# EAGLE design FG with AD9833 (EAGLE 7.7.0)
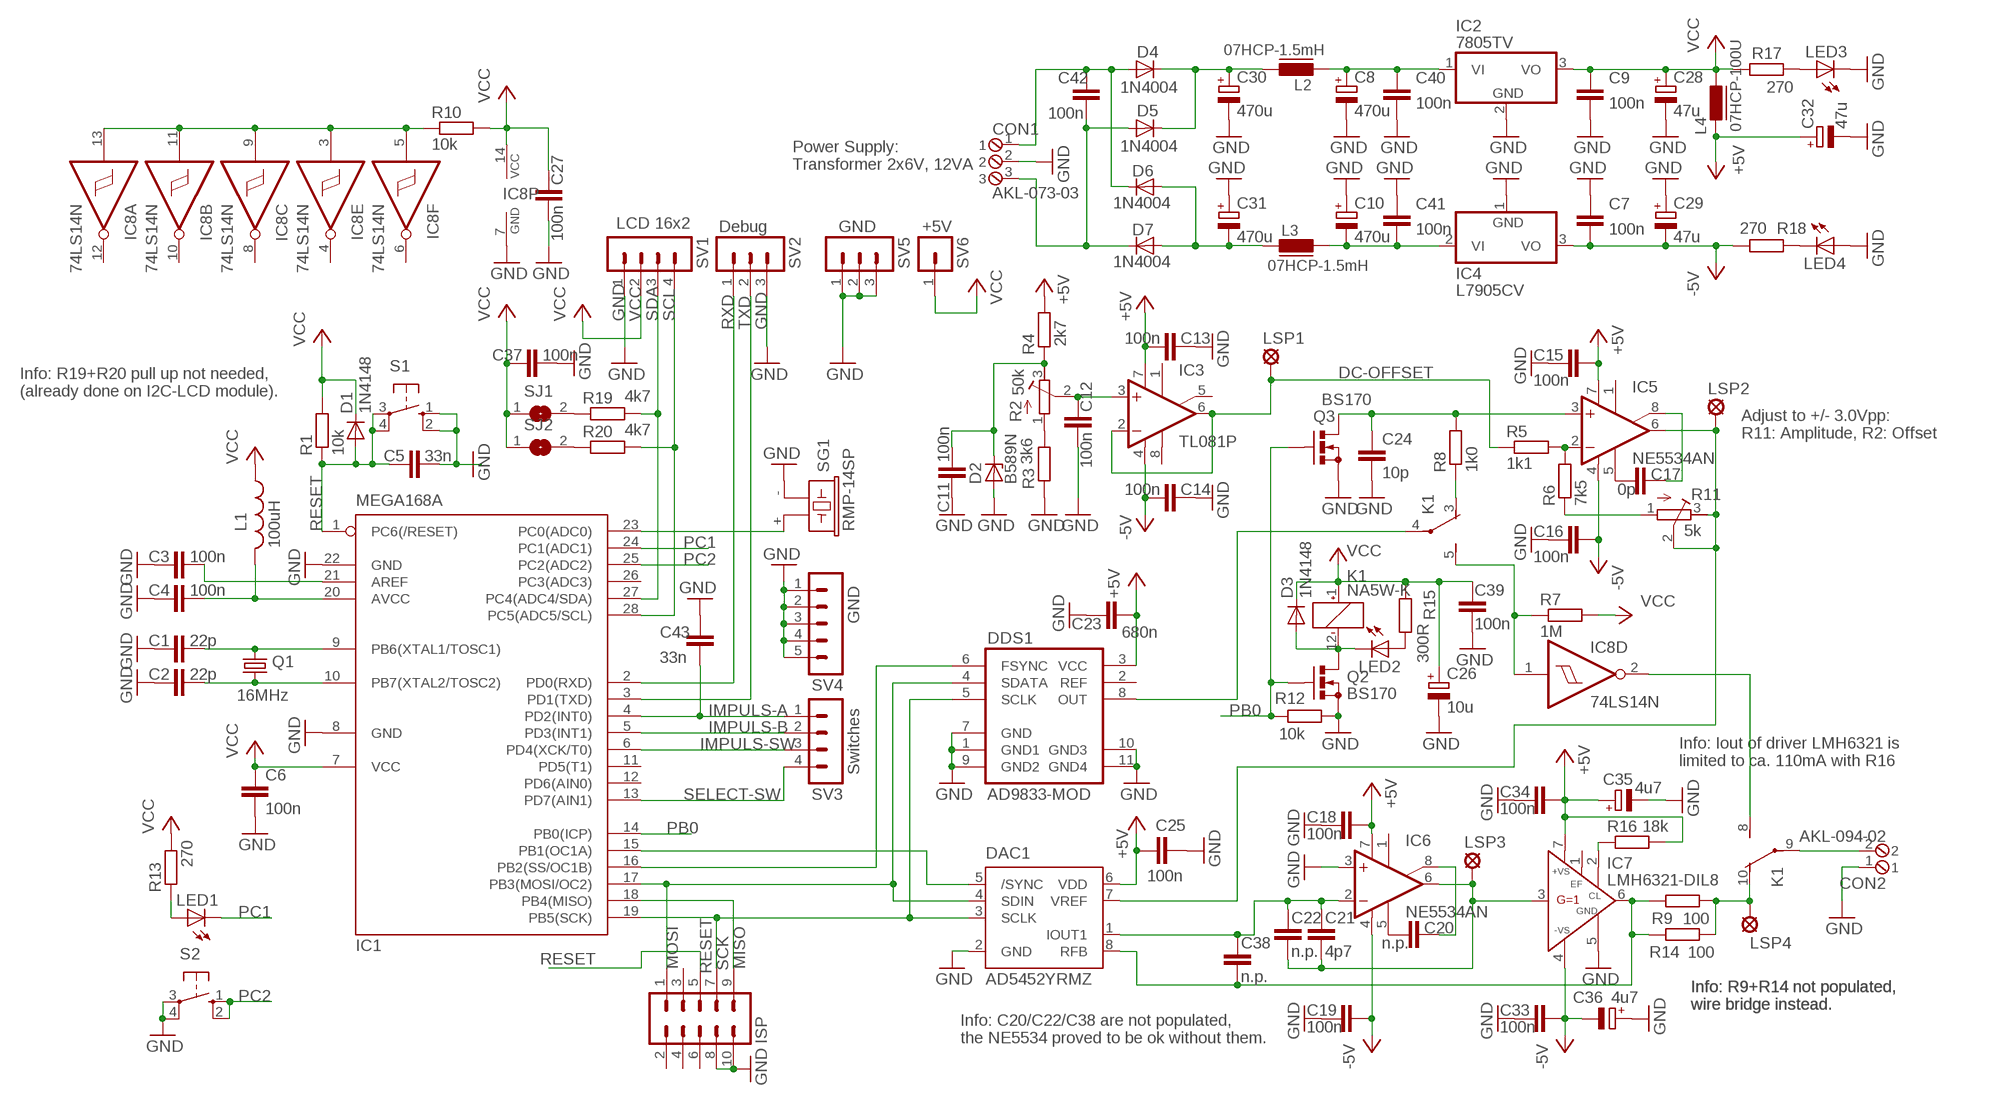
[diagram p0: schematic, sheet 1]

## Parts
C1  22p  C-EU025-024X044  [C025-024X044]
C2  22p  C-EU025-024X044  [C025-024X044]
C3  100n  C-EU050-024X044  [C050-024X044]
C4  100n  C-EU050-024X044  [C050-024X044]
C5  33n  C-EU025-024X044  [C025-024X044]
C6  100n  C-EU050-024X044  [C050-024X044]
C7  100n  C-EU050-024X044  [C050-024X044]
C8  470u  CPOL-EUE3.5-8  [E3,5-8]
C9  100n  C-EU050-024X044  [C050-024X044]
C10  470u  CPOL-EUE3.5-8  [E3,5-8]
C11  100n  C-EU050-024X044  [C050-024X044]
C12  100n  C-EU050-024X044  [C050-024X044]
C13  100n  C-EU050-024X044  [C050-024X044]
C14  100n  C-EU050-024X044  [C050-024X044]
C15  100n  C-EU050-024X044  [C050-024X044]
C16  100n  C-EU050-024X044  [C050-024X044]
C17  0p  C-EU025-024X044  [C025-024X044]
C18  100n  C-EU050-024X044  [C050-024X044]
C19  100n  C-EU050-024X044  [C050-024X044]
C20  n.p.  C-EU025-024X044  [C025-024X044]
C21  4p7  C-EU025-024X044  [C025-024X044]
C22  n.p.  C-EU025-024X044  [C025-024X044]
C23  680n  C-EU050-024X044  [C050-024X044]
C24  10p  C-EU025-024X044  [C025-024X044]
C25  100n  C-EU050-024X044  [C050-024X044]
C26  10u  CPOL-EUTT2D4  [TT2D4]
C27  100n  C-EU050-024X044  [C050-024X044]
C28  47u  CPOL-EUE2.5-6  [E2,5-6]
C29  47u  CPOL-EUE2.5-6  [E2,5-6]
C30  470u  CPOL-EUE3.5-8  [E3,5-8]
C31  470u  CPOL-EUE3.5-8  [E3,5-8]
C32  47u  CPOL-EUE2.5-6  [E2,5-6]
C33  100n  C-EU050-024X044  [C050-024X044]
C34  100n  C-EU050-024X044  [C050-024X044]
C35  4u7  CPOL-EUTT2D4  [TT2D4]
C36  4u7  CPOL-EUTT2D4  [TT2D4]
C37  100n  C-EU050-024X044  [C050-024X044]
C38  n.p.  C-EU025-024X044  [C025-024X044]
C39  100n  C-EU050-024X044  [C050-024X044]
C40  100n  C-EU050-024X044  [C050-024X044]
C41  100n  C-EU050-024X044  [C050-024X044]
C42  100n  C-EU050-024X044  [C050-024X044]
C43  33n  C-EU050-024X044  [C050-024X044]
CON1  AKL-073-03  [AKL-073-03]
CON2  AKL-094-02  [AKL-094-02]
D1  1N4148  1N4148DO35-10  [DO35-10]
D2  B589N  [TO-92H]
D3  1N4148  1N4148DO35-7  [DO35-7]
D4  1N4004  [DO41-10]
D5  1N4004  [DO41-10]
D6  1N4004  [DO41-10]
D7  1N4004  [DO41-10]
DAC1  AD5452YRMZ  [MSOP08]
DDS1  AD9833-MOD  [AD9833-MOD]
IC1  MEGA168A  MEGA8-P  [DIL28-3]
IC2  7805TV  [TO220V]
IC3  TL081P  [DIL08]
IC4  L7905CV  [TO220-V]
IC5  NE5534AN  [DIL08]
IC6  NE5534AN  [DIL08]
IC7  LMH6321-DIL8  [DIL08-ADAP]
IC8  74LS14N  [DIL14]
ISP  ML10  [ML10]
K1  NA5W-K  [HX]
L1  100uH  L-US0207/10  [0207/10]
L2  07HCP-1.5mH  07HCP-100U  [FASTRON_07HCP_INDUCTOR]
L3  07HCP-1.5mH  07HCP-100U  [FASTRON_07HCP_INDUCTOR]
L4  07HCP-100U  [FASTRON_07HCP_INDUCTOR]
LED1  LED5MM  [LED5MM]
LED2  LED5MM  [LED5MM]
LED3  LED5MM  [LED5MM]
LED4  LED5MM  [LED5MM]
LSP1  LSP11  [LSP11]
LSP2  LSP11  [LSP11]
LSP3  LSP11  [LSP11]
LSP4  LSP11  [LSP11]
Q1  16MHz  CRYSTALHC49S  [HC49/S]
Q2  BS170  [SOT54E]
Q3  BS170  [SOT54E]
R1  10k  R-EU_0207/10  [0207/10]
R2  50k  R-TRIMM64W  [RTRIM64W]
R3  3k6  R-EU_0207/10  [0207/10]
R4  2k7  R-EU_0207/10  [0207/10]
R5  1k1  R-EU_0207/10  [0207/10]
R6  7k5  R-EU_0207/10  [0207/10]
R7  1M  R-EU_0207/10  [0207/10]
R8  1k0  R-EU_0207/10  [0207/10]
R9  100  R-EU_0207/10  [0207/10]
R10  10k  R-EU_0207/10  [0207/10]
R11  5k  R-TRIMM64W  [RTRIM64W]
R12  10k  R-EU_0207/10  [0207/10]
R13  270  R-EU_0207/10  [0207/10]
R14  100  R-EU_0207/10  [0207/10]
R15  300R  R-EU_0207/10  [0207/10]
R16  18k  R-EU_0207/10  [0207/10]
R17  270  R-EU_0207/10  [0207/10]
R18  270  R-EU_0207/10  [0207/10]
R19  4k7  R-EU_0207/10  [0207/10]
R20  4k7  R-EU_0207/10  [0207/10]
S1  10-XX  [B3F-10XX]
S2  10-XX  [B3F-10XX]
SG1  RMP-14SP  F/CM12P  [F/CM12P]
SJ1  SJ  [SJ]
SJ2  SJ  [SJ]
SV1  MA04-1  [MA04-1]
SV2  MA03-1  [MA03-1]
SV3  MA04-1  [MA04-1]
SV4  MA05-1  [MA05-1]
SV5  MA03-1  [MA03-1]
SV6  MA01-1  [MA01-1]

## Nets
+5V [Stromversorgung]: C13.2 C15.2 C18.2 C23.2 C25.1 C32.+ C34.2 C35.+ DAC1.6(VDD) DDS1.3(VCC) IC3.7(V+) IC5.7(V+) IC6.7(V+) IC7.7(+VS) L4.1 R4.2 R16.2
-5V [Stromversorgung]: C7.2 C14.2 C16.2 C19.2 C29.- C33.2 C36.- IC3.4(V-) IC4.3(VO) IC5.4(V-) IC6.4(V-) IC7.4(-VS) R18.1
AREF: C3.2 IC1.21(AREF)
AVCC [Stromversorgung]: C4.2 IC1.20(AVCC) L1.2
DC-OFFSET: IC3.2(-IN) IC3.6(OUT) LSP1.MP R5.1
GND [Stromversorgung]: C1.1 C2.1 C3.1 C4.1 C5.2 C6.2 C7.1 C8.- C9.2 C10.+ C11.1 C12.2 C13.1 C14.1 C15.1 C16.1 C18.1 C19.1 C23.1 C24.2 C25.2 C26.- C27.2 C28.- C29.+ C30.- C31.+ C32.- C33.1 C34.1 C35.- C36.+ C37.2 C39.1 C40.2 C41.1 C43.1 CON1.2 CON2.1 D2.2(A) DAC1.2(GND) DDS1.1(GND1) DDS1.7(GND) DDS1.9(GND2) DDS1.10(GND3) DDS1.11(GND4) IC1.8(GND) IC1.22(GND) IC2.2(GND) IC4.1(GND) IC6.3(+IN) IC7.5(GND) IC8.7(P:GND) ISP.8 ISP.10 LED3.K(C) LED4.A Q2.S Q3.S R3.1 R12.1 S1.1(S) S1.2(S1) S2.3(P) S2.4(P1) SG1.- SV1.1 SV2.3 SV4.1 SV4.2 SV4.3 SV4.4 SV4.5 SV5.1 SV5.2 SV5.3
IMPULS-A: C43.2 IC1.4(PD2(INT0)) SV3.1
IMPULS-B: IC1.5(PD3(INT1)) SV3.2
IMPULS-SW: IC1.6(PD4(XCK/T0)) SV3.3
MISO: IC1.18(PB4(MISO)) ISP.9
MOSI: DAC1.4(SDIN) DDS1.4(SDATA) IC1.17(PB3(MOSI/OC2)) ISP.1
N$1: R2.1(A) R3.2
N$2: DDS1.6(FSYNC) IC1.16(PB2(SS/OC1B))
N$3: DAC1.5(/SYNC) IC1.15(PB1(OC1A))
N$4: IC5.2(-IN) R5.2 R6.2
N$5 [Stromversorgung 2]: C8.+ C40.1 IC2.1(VI) L2.1
N$6: IC8.1(D:I) K1.5(2:S) R7.1
N$7 [Stromversorgung 2]: C31.- D6.A D7.A L3.1
N$8: DDS1.8(OUT) K1.4(2:P)
N$9: C17.1 IC5.5(CMP)
N$10: C17.2 IC5.8(ON/CMP)
N$11: K1.3(2:O) R8.1
N$12: R6.1 R11.1(A)
N$13: LED1.A R13.1
N$14 [Stromversorgung 2]: C30.+ D4.C D5.C L2.2
N$15 [Stromversorgung 2]: C10.- C41.2 IC4.2(VI) L3.2
N$16 [Stromversorgung 2]: C42.1 CON1.1 D4.A D6.C
N$17: C21.2 C22.2 IC6.6(OUT) IC7.3(IN) LSP3.MP
N$18: IC1.23(PC0(ADC0)) SG1.+
N$19 [Stromversorgung 2]: C42.2 CON1.3 D5.A D7.C
N$20: IC8.3(E:I) IC8.5(F:I) IC8.9(C:I) IC8.11(B:I) IC8.13(A:I) R10.1
N$21: IC7.2(CL) R16.1
N$22: C38.2 DAC1.8(RFB) IC7.6(OUT) R9.2 R14.2
N$23: K1.10(3:O) LSP4.MP R9.1 R14.1
N$24: LED3.A R17.1
N$25: LED4.K(C) R18.2
N$26: C20.1 IC6.5(CMP)
N$27: R19.1 SJ1.2
N$28: C20.2 IC6.8(ON/CMP)
N$29: C21.1 C22.1 C38.1 DAC1.1(IOUT1) IC6.2(-IN)
N$30: R20.1 SJ2.2
N$31: CON2.2 K1.9(3:P)
N$32: C24.1 IC5.3(+IN) Q3.D R8.2
N$34: C12.1 IC3.3(+IN) R2.2(S)
N$35: C11.2 D2.1(C) R2.3(E) R4.1
N$37: D3.A K1.12(1:-) LED2.K(C) Q2.D
N$38: IC8.2(D:O) K1.8(3:S)
N$48: LED2.A R15.2
OSC1: C1.2 IC1.9(PB6(XTAL1/TOSC1)) Q1.2
OSC2: C2.2 IC1.10(PB7(XTAL2/TOSC2)) Q1.1
PB0: IC1.14(PB0(ICP)) Q2.G Q3.G R12.2
PC1: IC1.24(PC1(ADC1)) LED1.K(C)
PC2: IC1.25(PC2(ADC2)) S2.1(S) S2.2(S1)
RESET: C5.1 D1.A IC1.1(PC6(/RESET)) ISP.5 R1.1 S1.3(P) S1.4(P1)
RXD: IC1.2(PD0(RXD)) SV2.1
SCK: DAC1.3(SCLK) DDS1.5(SCLK) IC1.19(PB5(SCK)) ISP.7
SCL: IC1.28(PC5(ADC5/SCL)) R20.2 SV1.4
SDA: IC1.27(PC4(ADC4/SDA)) R19.2 SV1.3
SELECT-SW: IC1.13(PD7(AIN1)) SV3.4
TXD: IC1.3(PD1(TXD)) SV2.2
VCC [Stromversorgung]: C6.1 C9.1 C26.+ C27.1 C28.+ C37.1 C39.2 D1.C D3.C IC1.7(VCC) IC2.3(VO) IC8.14(P:VCC) K1.1(1:+) L1.1 L4.2 R1.2 R7.2 R10.2 R13.2 R15.1 R17.2 SJ1.1 SJ2.1 SV1.2 SV6.1
VREF: DAC1.7(VREF) IC5.6(OUT) LSP2.MP R11.2(S) R11.3(E)
Unconnected: DDS1.2(REF) IC1.11(PD5(T1)) IC1.12(PD6(AIN0)) IC1.26(PC3(ADC3)) IC3.1(ON1) IC3.5(ON2) IC3.8(OPT) IC5.1(ON) IC6.1(ON) IC7.1(EF) IC8.4(E:O) IC8.6(F:O) IC8.8(C:O) IC8.10(B:O) IC8.12(A:O) ISP.2 ISP.3 ISP.4 ISP.6

## Notes on the sheet
- Power Supply: 
  Transformer 2x6V, 12VA
- Debug | GND | +5V
- LCD 16x2
- Info: R19+R20 pull up not needed,
  (already done on I2C-LCD module).
- Adjust to +/- 3.0Vpp:
  R11: Amplitude, R2: Offset
- GND
- Info: Iout of driver LMH6321 is
  limited to ca. 110mA with R16
- Switches
- Info: R9+R14 not populated,
  wire bridge instead.
- Info: R9+R14 not populated,
  wire bridge instead.
- Info: C20/C22/C38 are not populated,
  the NE5534 proved to be ok without them.

## Library data of the parts
C1-C7 C9 C11-C25 C27 C33 C34 C37-C43 = rcl:C-EU: CAPACITOR, European symbol
C8 C10 C26 C28-C32 C35 C36 = rcl:CPOL-EU: POLARIZED CAPACITOR, European symbol
CON1 = tj-library:AKL-073-03: Riacon AKL-073, Raster 5.08 mm, Polzahl 3
CON2 = tj-library:AKL-094-02: Riacon AKL-094, Raster 5.08 mm, Polzahl 2
D1 D3 = diode:1N4148: DIODE high speed (Philips)
D2 = tj-library:B589N: 1.235V Reference
D4-D7 = diode:1N4004: DIODE general purpose rectifier, 1 A
DAC1 = tj-library:AD5452YRMZ: AD5452YRMZ DAC-Converter with Serial Interface in Package MSOP-8
DDS1 = tj-library:AD9833-MOD: AD9833 DDS-Modul (Made in China)
IC1 = atmel:MEGA8-P: MICROCONTROLLER 8 Kbytes FLASH, 1 kbytes SRAM, 512 bytes EEPROM, USART, 4-channel 10 bit ADC, 2-channel 8 bit ADC Pin compatible with Atmega48, ATMega88, ATMega168 Source: avr.lbr; OC_FARNELL: unknown; OC_NEWARK: unknown
IC2 = linear:78*: Positive VOLTAGE REGULATOR Source: http://cache.national.com/ds/LM/LM78L05.pdf http://www.fairchildsemi.com/ds/LM/LM7805.pdf
IC3 = linear:TL081: OP AMP
IC4 = tj-library:L7905CV: Negative Voltage Regulator
IC5 IC6 = linear:NE5534: LOW-NOISE OPERATIONAL AMPLIFIER Source: http://focus.ti.com/lit/ds/symlink/ne5534.pdf
IC7 = tj-library:LMH6321-DIL8: LMH6321 on SOIC-8 to DIP-8 Adapter
IC8 = 74xx-eu:74*14: Hex schmitt trigger INVERTER
ISP = con-ml:ML10: HARTING; OC_FARNELL: unknown; OC_NEWARK: unknown
K1 = tj-library:NA5W-K: Relais Takamisawa NA5W-K
L1 = rcl:L-US: INDUCTOR, American symbol
L2-L4 = fastron_07HCP:07HCP-*: Fastron 07 HCP Series Inductors (Ferrite Core) (1 … 10000)uH, THT vertical assembly, 5 mm grid / 8.3 mm max. diameter / 10 mm max. height RoHS-Compliant Source: www.fastrongroup.co Technologies: 07HCP-… L/uH RDCmax/Ω IN/A Isat/A 1R0 1 0.06 7.5 10 2R2 2.2 0.01 6 8 3R3 3.3 0.013 5 6.3 4R7 4.7 0.018 4 5.4 6R8 6.8 0.025 3.8 6.5 100 10 0.04 2.6 5 220 22 0.055 2.3 3.6 470 47 0.1 1.3 2.5 680 68 0.14 1.1 2.1 820 82 0.16 1 1.9 101 100 0.19 0.9 1.6 121 120 0.22 0.85 1 221 220 0.38 0.64 1.2 331 330 0.7 0.51 0.85 471 470 0.89 0.43 0.8 821 820 1.56 0.36 0.7 102 1000 1.84 0.3 0.5 182 1800 3.3 0.21 0.35 103 10000 24 0.14 0.17 ±10% / ±20% fL = 1 kHz | 0.25 V Author: Dipl.-Ing. FH Rainer Bayer HHN Hochschule Heilbronn, rainer.bayer@hs-heilbronn.de Ingenieurbüro ing-rb, mail@ing-rb.de; FASTRON#: 07HCP-101
LED1-LED4 = led:LED: LED OSRAM: - CHIPLED LG R971, LG N971, LY N971, LG Q971, LY Q971, LO R971, LY R971 LH N974, LH R974 LS Q976, LO Q976, LY Q976 LO Q996 - Hyper CHIPLED LW Q18S LB Q993, LB Q99A, LB R99A - SideLED LS A670, LO A670, LY A670, LG A670, LP A670 LB A673, LV A673, LT A673, LW A673 LH A674 LY A675 LS A676, LA A676, LO A676, LY A676, LW A676 LS A679, LY A679, LG A679 - Hyper Micro SIDELED® LS Y876, LA Y876, LO Y876, LY Y876 LT Y87S - SmartLED LW L88C, LW L88S LB L89C, LB L89S, LG L890 LS L89K, LO L89K, LY L89K LS L896, LA L896, LO L896, LY L896 - TOPLED LS T670, LO T670, LY T670, LG T670, LP T670 LSG T670, LSP T670, LSY T670, LOP T670, LYG T670 LG T671, LOG T671, LSG T671 LB T673, LV T673, LT T673, LW T673 LH T674 LS T676, LA T676, LO T676, LY T676, LB T676, LH T676, LSB T676, LW T676 LB T67C, LV T67C, LT T67C, LS T67K, LO T67K, LY T67K, LW E67C LS E67B, LA E67B, LO E67B, LY E67B, LB E67C, LV E67C, LT E67C LW T67C LS T679, LY T679, LG T679 LS T770, LO T770, LY T770, LG T770, LP T770 LB T773, LV T773, LT T773, LW T773 LH T774 LS E675, LA E675, LY E675, LS T675 LS T776, LA T776, LO T776, LY T776, LB T776 LHGB T686 LT T68C, LB T68C - Hyper Mini TOPLED® LB M676 - Mini TOPLED Santana® LG M470 LS M47K, LO M47K, LY M47K Source: http://www.osram.convergy.de LUXEON: - LUMILED® LXK2-PW12-R00, LXK2-PW12-S00, LXK2-PW14-U00, LXK2-PW14-V00 LXK2-PM12-R00, LXK2-PM12-S00, LXK2-PM14-U00 LXK2-PE12-Q00, LXK2-PE12-R00, LXK2-PE12-S00, LXK2-PE14-T00, LXK2-PE14-U00 LXK2-PB12-K00, LXK2-PB12-L00, LXK2-PB12-M00, LXK2-PB14-N00, LXK2-PB14-P00, LXK2-PB14-Q00 LXK2-PR12-L00, LXK2-PR12-M00, LXK2-PR14-Q00, LXK2-PR14-R00 LXK2-PD12-Q00, LXK2-PD12-R00, LXK2-PD12-S00 LXK2-PH12-R00, LXK2-PH12-S00 LXK2-PL12-P00, LXK2-PL12-Q00, LXK2-PL12-R00 Source: www.luxeon.com KINGBRIGHT: KA-3528ASYC Source: www.kingbright.com
LSP1-LSP4 = solpad:LSP11: SOLDER PAD drill 1.1 mm
Q1 = crystal:CRYSTAL: CRYSTAL; OC_FARNELL: 1667008; OC_NEWARK: unknown
Q2 Q3 = transistor-small-signal:BS170: N-CHANNEL MOS FET
R1 R3-R10 R12-R20 = rcl:R-EU_: RESISTOR, European symbol
R2 R11 = rcl:R-TRIMM: Trimm resistor
S1 S2 = switch-omron:10-XX: OMRON SWITCH; MPN: B3F-1000; OC_FARNELL: 176432; OC_NEWARK: 36M3542
SG1 = buzzer:F/CM12P: BUZZER Source: Buerklin; OC_FARNELL: unknown; OC_NEWARK: unknown
SJ1 SJ2 = jumper:SJ: SMD solder JUMPER
SV1 SV3 = con-lstb:MA04-1: PIN HEADER; OC_FARNELL: unknown; OC_NEWARK: unknown
SV2 SV5 = con-lstb:MA03-1: PIN HEADER; OC_FARNELL: unknown; OC_NEWARK: unknown
SV4 = con-lstb:MA05-1: PIN HEADER; OC_FARNELL: unknown; OC_NEWARK: unknown
SV6 = tj-library:MA01-1: PIN HEADER

## Net classes
0 default: width 0.406 mm, clearance 0.203 mm
1 Stromversorgung: width 0.406 mm, clearance 0.203 mm
2 Stromversorgung 2: width 1.422 mm, clearance 0.61 mm

## Board
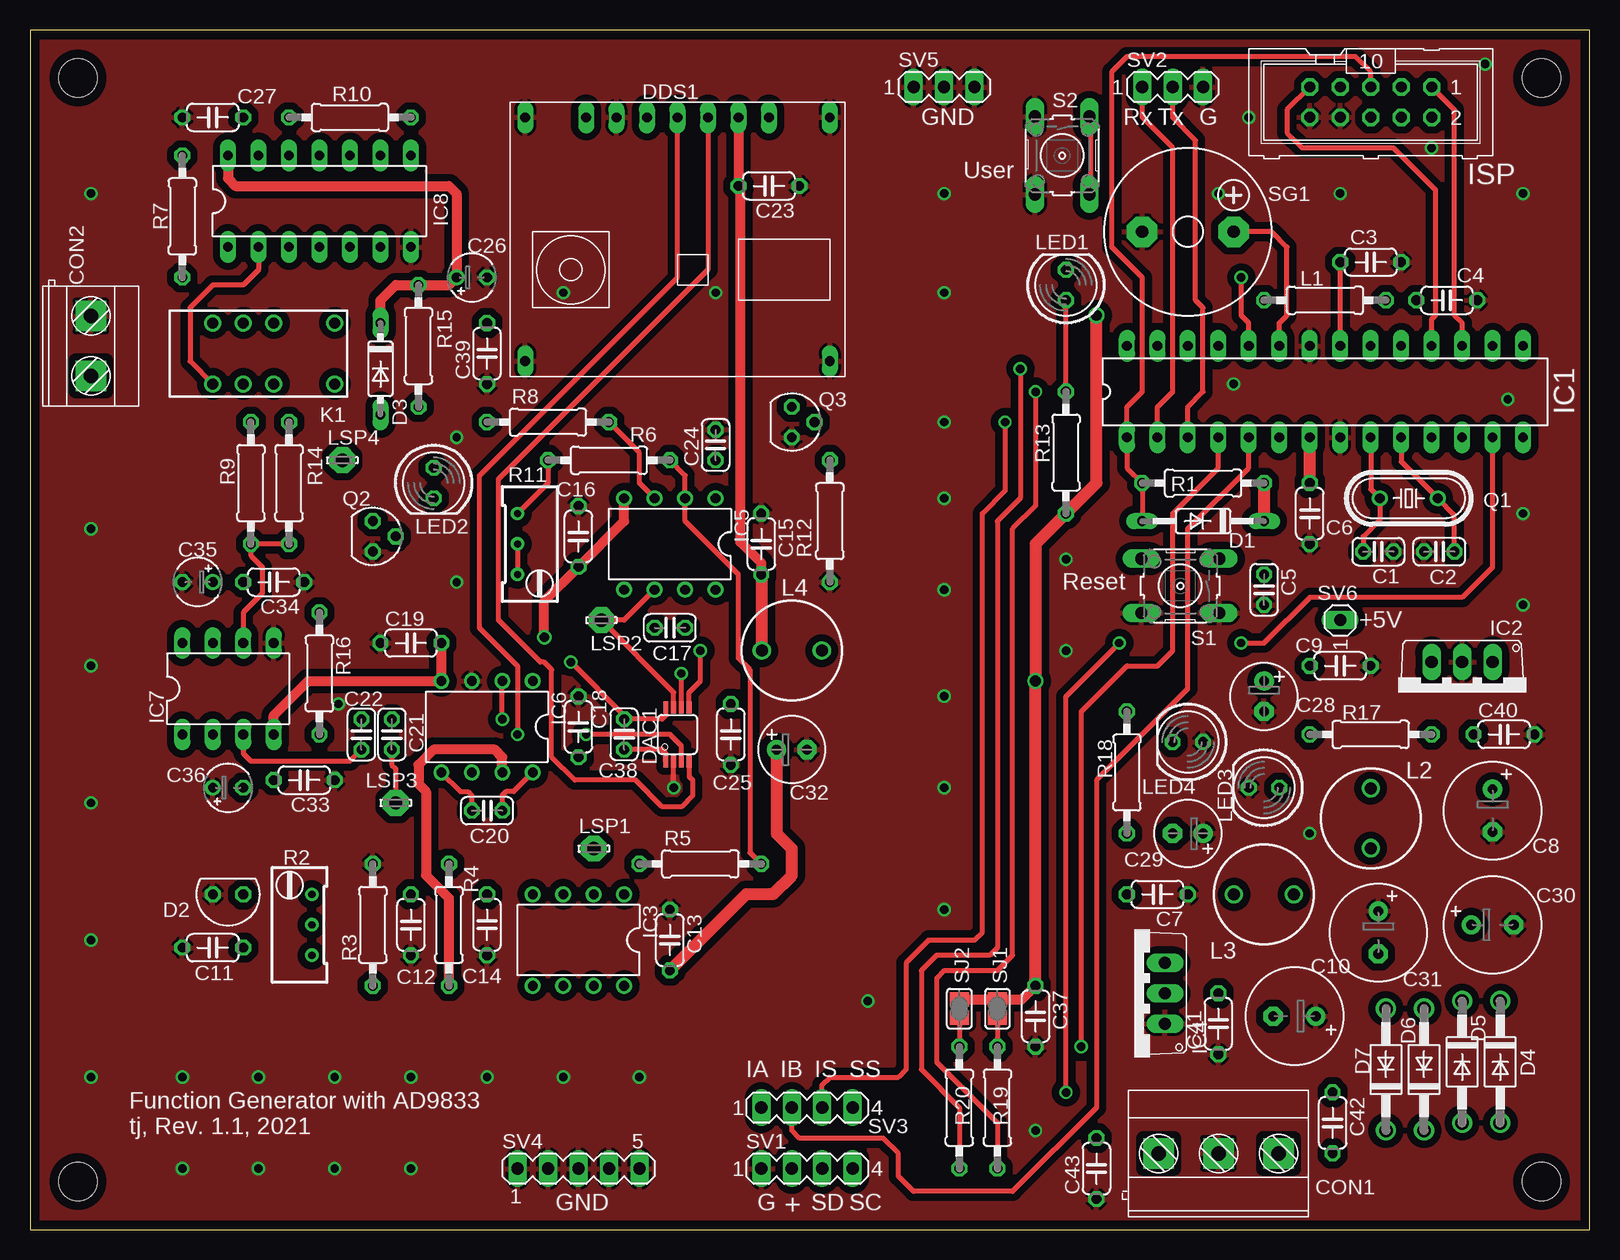
[diagram p1: board, top side]
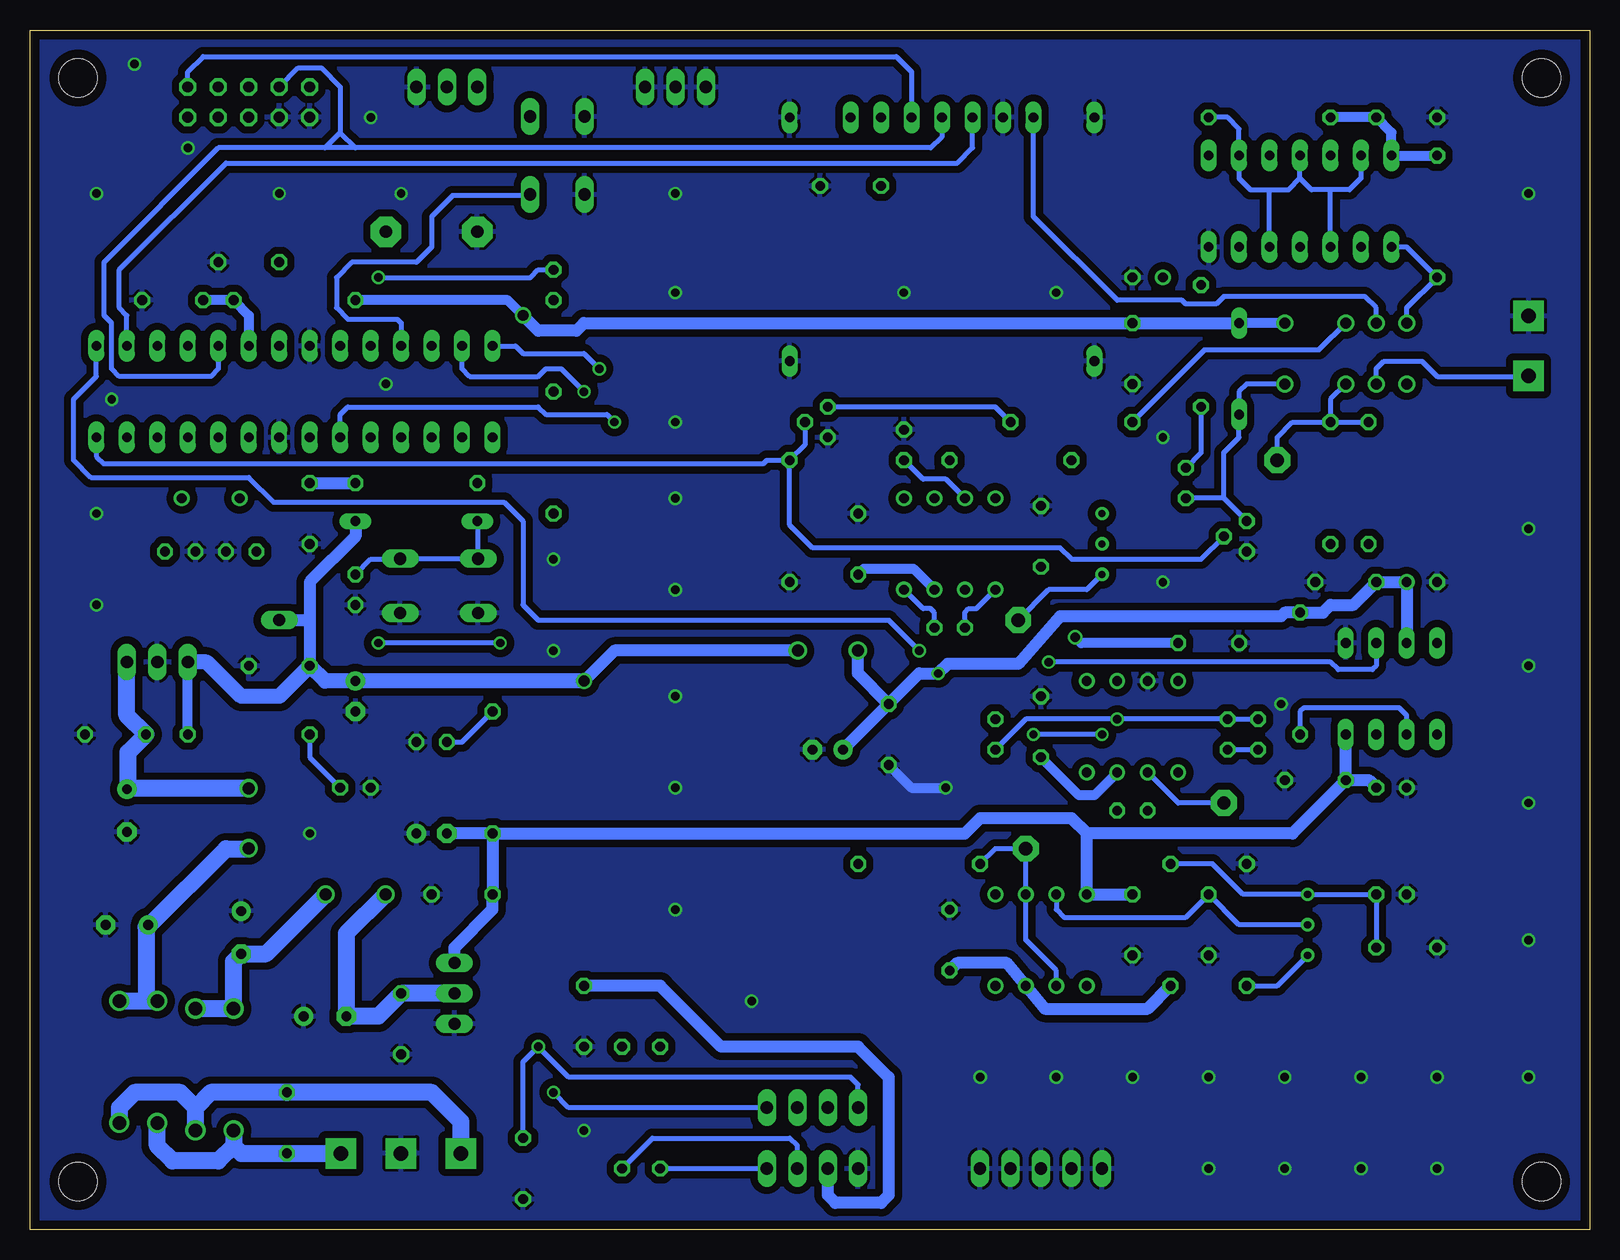
[diagram p2: board, bottom side, seen from below]

Size 130 x 100 mm. Coordinates in mm from the lower left corner, seen from the top.
Outline: 0,0 130,0 130,100 0,100 0,0
Copper layers (1*16): Top 0.035mm / dielectric 1.5mm / Bottom 0.035mm
Design rules "default *": minimum track width 10mil, minimum drill 24mil, track to track 8mil, track to pad 8mil, pad to pad 8mil, via to via 8mil, smd to smd 8mil, copper to edge 30mil, drill to drill 8mil, minimum pad ring 10mil, minimum via ring 8mil, stop-mask expansion 4mil, vias tented up to drill 0mil, thermal gap 10mil
Holes 3.2 mm at 4,96 4,4 126,4 126,96

### Footprints (pad centres in the part's own frame; a part is rotated, then mirrored left to right if it is on the bottom)
C025-024X044 = drill 0.813 octagon: 1 -1.27,0; 2 1.27,0
C050-024X044 = drill 0.813 octagon: 1 -2.54,0; 2 2.54,0
E3,5-8 = drill 0.813 pad 1.6: + -1.778,0 | drill 0.813 pad 1.6 octagon: - 1.778,0
TT2D4 = drill 0.813: + -1.27,0 | drill 0.813 octagon: - 1.27,0
E2,5-6 = drill 0.813 pad 1.6: + -1.27,0 | drill 0.813 pad 1.6 octagon: - 1.27,0
AKL-073-03 = drill 1.2 pad 2.54 square: 1 -4.98,0; 2 0.02,0; 3 5.02,0
AKL-094-02 = drill 1.2 pad 2.54 square: 1 -2.5,0; 2 2.5,0
DO35-10 = drill 0.813 long: A 5.08,0; C -5.08,0
TO-92H = drill 0.813 octagon: 1 -1.27,0; 2 1.27,0
DO35-7 = drill 0.813 long: A 3.81,0; C -3.81,0
DO41-10 = drill 1.118: A 5.08,0; C -5.08,0
MSOP08 = smd 0.4 x 1: 1 -0.976,-2.263; 2 -0.326,-2.263; 3 0.324,-2.263; 4 0.974,-2.263; 5 0.974,2.262; 6 0.324,2.262; 7 -0.326,2.262; 8 -0.976,2.262
AD9833-MOD = drill 0.813 long: 1 -12.7,-10.16; 2 -7.62,-10.16; 3 -5.08,-10.16; 4 -2.54,-10.16; 5 0,-10.16; 6 2.54,-10.16; 7 5.08,-10.16; 8 7.62,-10.16; 9 12.7,-10.16; 10 12.7,10.16; 11 -12.7,10.16
DIL28-3 = drill 0.813 long: 1 -16.51,-3.81; 2 -13.97,-3.81; 3 -11.43,-3.81; 4 -8.89,-3.81; 5 -6.35,-3.81; 6 -3.81,-3.81; 7 -1.27,-3.81; 8 1.27,-3.81; 9 3.81,-3.81; 10 6.35,-3.81; 11 8.89,-3.81; 12 11.43,-3.81; 13 13.97,-3.81; 14 16.51,-3.81; 15 16.51,3.81; 16 13.97,3.81; 17 11.43,3.81; 18 8.89,3.81; 19 6.35,3.81; 20 3.81,3.81; 21 1.27,3.81; 22 -1.27,3.81; 23 -3.81,3.81; 24 -6.35,3.81; 25 -8.89,3.81; 26 -11.43,3.81; 27 -13.97,3.81; 28 -16.51,3.81
TO220V = drill 1.016 long: 1 -2.54,-2.54; 2 0,-2.54; 3 2.54,-2.54
DIL08 = drill 0.813 pad 1.27: 1 -3.81,-3.81; 2 -1.27,-3.81; 3 1.27,-3.81; 4 3.81,-3.81; 5 3.81,3.81; 6 1.27,3.81; 7 -1.27,3.81; 8 -3.81,3.81
TO220-V = drill 1.016 long: 1 -2.54,0; 2 0,0; 3 2.54,0
DIL08-ADAP = drill 0.813 long: 1 -3.81,-3.81; 2 -1.27,-3.81; 3 1.27,-3.81; 4 3.81,-3.81; 5 3.81,3.81; 6 1.27,3.81; 7 -1.27,3.81; 8 -3.81,3.81
DIL14 = drill 0.813 long: 1 -7.62,-3.81; 2 -5.08,-3.81; 3 -2.54,-3.81; 4 0,-3.81; 5 2.54,-3.81; 6 5.08,-3.81; 7 7.62,-3.81; 8 7.62,3.81; 9 5.08,3.81; 10 2.54,3.81; 11 0,3.81; 12 -2.54,3.81; 13 -5.08,3.81; 14 -7.62,3.81
ML10 = drill 0.914 octagon: 1 -5.08,-1.27; 2 -5.08,1.27; 3 -2.54,-1.27; 4 -2.54,1.27; 5 0,-1.27; 6 0,1.27; 7 2.54,-1.27; 8 2.54,1.27; 9 5.08,-1.27; 10 5.08,1.27
HX = drill 0.9: 1 -6.35,-2.54; 3 -1.27,-2.54; 4 1.27,-2.54; 5 3.81,-2.54; 8 3.81,2.54; 9 1.27,2.54; 10 -1.27,2.54; 12 -6.35,2.54
0207/10 = drill 0.813 octagon: 1 -5.08,0; 2 5.08,0
FASTRON_07HCP_INDUCTOR = drill 1: 1 -2.5,0; 2 2.5,0
LED5MM = drill 0.813 octagon: A -1.27,0; K 1.27,0
LSP11 = drill 1.118 pad 2.159 octagon: MP 0,0
HC49/S = drill 0.813: 1 -2.413,0; 2 2.413,0
SOT54E = drill 0.813 octagon: D -1.27,0; G 0,1.905; S 1.27,0
RTRIM64W = drill 0.61: 1 1.27,-2.54; 2 1.27,0; 3 1.27,2.54
B3F-10XX = drill 1.016 long: 1 -3.251,2.261; 2 3.251,2.261; 3 -3.251,-2.261; 4 3.251,-2.261
F/CM12P = drill 1.016 pad 2.54 octagon: + 3.81,0; - -3.81,0
SJ = smd 1.168 x 1.6: 1 -0.762,0; 2 0.762,0
MA04-1 = drill 1.016 long: 1 -3.81,0; 2 -1.27,0; 3 1.27,0; 4 3.81,0
MA03-1 = drill 1.016 long: 1 -2.54,0; 2 0,0; 3 2.54,0
MA05-1 = drill 1.016 long: 1 -5.08,0; 2 -2.54,0; 3 0,0; 4 2.54,0; 5 5.08,0
MA01-1 = drill 1.016 long: 1 0,0

### Placement (x,y rotation side)
C1  112.39,56.52 180 top
C2  117.47,56.52 0 top
C3  111.76,80.64 180 top
C4  118.11,77.47 180 top
C5  102.87,53.34 270 top
C6  106.68,59.69 270 top
C7  93.98,27.94 180 top
C8  121.92,34.92 270 top
C9  109.22,46.99 0 top
C10  105.41,17.78 180 top
C11  15.24,23.5 0 top
C12  31.75,25.4 270 top
C13  53.34,24.13 270 top
C14  38.1,25.4 90 top
C15  60.96,57.15 270 top
C16  45.72,57.78 270 top
C17  53.34,50.16 0 top
C18  45.72,41.91 270 top
C19  31.75,48.9 0 top
C20  38.1,34.92 0 top
C21  30.16,41.27 270 top
C22  27.62,41.27 270 top
C23  61.59,87 180 top
C24  57.15,65.41 90 top
C25  58.42,41.27 270 top
C26  36.83,79.38 0 top
C27  15.24,92.71 180 top
C28  102.87,44.45 270 top
C29  96.52,33.02 180 top
C30  121.92,25.4 0 top
C31  112.39,24.77 270 top
C32  63.5,40.01 0 top
C33  22.86,37.47 180 top
C34  20.32,53.98 180 top
C35  13.97,53.98 180 top
C36  16.51,36.83 0 top
C37  83.82,17.78 270 top
C38  49.53,41.27 90 top
C39  38.1,73.03 90 top
C40  122.87,41.27 0 top
C41  99.06,17.14 90 top
C42  108.58,8.89 270 top
C43  88.9,5.08 90 top
CON1  99.06,6.35 0 top
CON2  5.08,73.66 270 top
D1  97.79,59.05 180 top
D2  16.51,27.94 180 top
D3  29.21,71.75 270 top
D4  122.56,13.97 270 top
D5  119.38,13.97 270 top
D6  116.2,13.34 90 top
D7  113.03,13.34 90 top
DAC1  53.98,41.27 0 top
DDS1  53.98,82.55 180 top
IC1  107.95,69.85 0 top
IC2  119.38,44.77 180 top
IC3  45.72,24.13 180 top
IC4  94.61,19.68 90 top
IC5  53.34,57.15 180 top
IC6  38.1,41.91 180 top
IC7  16.51,45.09 0 top
IC8  24.13,85.72 0 top
ISP  111.76,93.98 180 top
K1  19.05,73.03 180 top
L1  107.95,77.47 0 top
L2  111.76,34.29 270 top
L3  102.87,27.94 180 top
L4  63.5,48.26 0 top
LED1  86.36,78.74 90 top
LED2  33.66,62.23 270 top
LED3  102.87,36.83 180 top
LED4  96.52,40.64 180 top
LSP1  46.99,31.75 0 top
LSP2  47.62,50.8 0 top
LSP3  30.48,35.56 0 top
LSP4  26.04,64.14 0 top
Q1  114.94,60.96 180 top
Q2  28.57,57.78 270 top
Q3  63.5,67.31 270 top
R1  97.79,62.23 0 top
R2  22.23,25.4 0 top
R3  28.57,25.4 270 top
R4  34.92,25.4 270 top
R5  55.88,30.48 0 top
R6  48.26,64.14 0 top
R7  12.7,84.45 90 top
R8  43.18,67.31 0 top
R9  18.41,62.23 270 top
R10  26.67,92.71 180 top
R11  41.91,57.15 180 top
R12  66.67,59.05 90 top
R13  86.36,64.77 270 top
R14  21.59,62.23 270 top
R15  32.38,73.66 270 top
R16  24.13,46.35 90 top
R17  111.76,41.27 0 top
R18  91.44,38.1 90 top
R19  80.64,10.16 270 top
R20  77.47,10.16 270 top
S1  95.89,53.66 180 top
S2  86.04,89.53 270 top
SG1  96.52,83.19 0 top
SJ1  80.64,18.41 270 top
SJ2  77.47,18.41 270 top
SV1  64.77,5.08 0 top
SV2  95.25,95.25 0 top
SV3  64.77,10.16 0 top
SV4  45.72,5.08 0 top
SV5  76.2,95.25 0 top
SV6  109.22,50.8 90 top

### Tracks (layer width: path | path; a pad name or v marks a point on that pad's centre or on a via)
+5V  (via drill 0.7)
  Top 0.406: DAC1.6 v54.3,46.35 v54.29,46.35
  Top 0.813: R4.2 34.92,27.62 33.02,29.53 33.02,36.51 32.38,37.15 32.38,38.73 33.66,40.01 38.73,40.01 39.37,39.37 IC6.7 | DDS1.3 C23.2 59.21,86.84 59.21,57.31 60.96,55.56 C15.2
  Top 1.016: C32.+ 62.23,33.02 63.5,31.75 63.5,29.53 61.91,27.94 59.69,27.94 C13.2 | C15.2 60.96,48.3 L4.1
  Bottom 0.813: IC5.7 56.36,55.09 60.48,55.09 C15.2 | IC6.7 41.27,36.2 42.55,36.2 C18.2
  Bottom 1.016: IC7.7 C35.+ C34.2 19.68,52.07 21.59,52.07 22.23,51.44 R16.2 25.4,51.44 25.72,51.12 44.13,51.12 47.62,47.15 53.5,47.15 v54.29,46.35 55.88,46.35 C25.1 | C25.1 C32.+ | R4.2 36.83,18.41 45.4,18.41 IC3.7 48.58,22.23 52.7,22.23 C13.2 | C25.1 61,46.4 L4.1
-5V  (via drill 0.8)
  Top 0.813: C19.2 IC6.4 23.18,45.72 20.32,42.86 IC7.4 | v42.86,49.37 42.86,52.39 C16.2 49.53,59.05 IC5.4
  Bottom 0.813: C33.2 20.64,37.31 20.64,37.15 | v42.86,49.37 42.39,48.9 C19.2
  Bottom 1.016: C14.2 IC3.4 41.91,33.02 | C36.- 18.41,37.47 C33.2 IC7.4 | R18.1 C29.- | R18.1 C7.2 91.44,26.67 94.61,23.5 IC4.3 | 20.64,37.15 24.77,33.02 41.91,33.02 | 41.91,33.02 43.18,34.29 50.8,34.29 52.07,33.02 R18.1
AREF
  Top 0.406: IC1.21 C3.2
AVCC
  Bottom 0.813: C4.2 L1.2 111.76,76.2 IC1.20
DC-OFFSET
  Bottom 0.406: R5.1 49.53,31.75 LSP1.MP IC3.2 46.99,24.13 44.45,21.59 IC3.6
GND  (via drill 0.7)
  Top 0.406: v53.66,36.83 DAC1.2
  Bottom 0.813: C25.2 56.52,36.83 v53.66,36.83
  other vias: 12.7,5.08 19.05,5.08 25.4,5.08 31.75,5.08 69.85,19.05 76.2,26.67 106.68,33.02 76.2,36.83 76.2,44.45 76.2,53.34 76.2,60.96 76.2,67.31 76.2,86.36 101.6,92.71 109.22,86.36 44.45,78.11 57.15,78.11 123.19,69.22 121.28,97.16 124.46,86.36 124.46,59.69 124.46,52.07 25.72,43.81 35.56,53.98 35.56,66.04 5.08,12.7 5.08,24.13 5.08,35.56 5.08,46.99 5.08,58.42 5.08,86.36 100.33,70.48 99.06,86.36 86.36,55.88 86.36,48.26 76.2,78.11 12.7,12.7 19.05,12.7 25.4,12.7 31.75,12.7 38.1,12.7 44.45,12.7 50.8,12.7 83.82,8.26 116.84,90.17
  pour Bottom (isolate 0.61): 0,0 0,100.01 130.18,100.01 130.18,0
  pour Top (isolate 0.61): 0,0 0,100.01 130.18,100.01 130.18,0
IMPULS-A  (via drill 0.7)
  Top 0.406: IC1.4 99.06,63.5 95.25,59.69 95.25,48.26 93.98,46.99 91.44,46.99 87.63,43.18 v87.63,15.24
  Bottom 0.406: SV3.1 60.96,12.06 61.59,12.7 85.09,12.7 v87.63,15.24 88.9,13.97 C43.2
IMPULS-B
  Top 0.406: IC1.5 101.6,63.5 96.52,58.42 96.52,45.09 88.9,37.47 88.9,10.16 81.92,3.17 73.66,3.17 72.39,4.45 72.39,6.35 71.12,7.62 64.14,7.62 63.5,8.26 SV3.2
IMPULS-SW  (via drill 0.7)
  Top 0.406: v81.28,67.31 81.28,61.59 79.38,59.69 79.38,24.77 78.74,24.13 74.93,24.13 73.03,22.23 73.03,13.34 72.39,12.7 66.67,12.7 66.04,12.06 SV3.3
  Bottom 0.406: IC1.6 104.14,67.94 103.5,68.58 87.63,68.58 87,67.94 81.92,67.94 v81.28,67.31
MISO
  Top 0.406: ISP.9 104.78,93.34 104.78,91.44 106.05,90.17 113.67,90.17 117.16,86.68 117.16,76.2 116.84,75.88 IC1.18
MOSI
  Top 0.406: DAC1.4 54.95,37.76 55.24,37.47 55.24,36.2 54.29,35.24 52.7,35.24 50.48,37.47 45.4,37.47 43.5,39.37 43.5,46.67 42.86,47.31 42.55,47.31 39.05,50.8 39.05,62.55 56.52,80.01 DDS1.4 | ISP.1 118.75,93.34 118.75,76.2 119.38,75.56 IC1.17
  Bottom 0.406: ISP.1 116.84,96.52 115.57,97.79 57.78,97.79 56.52,96.52 DDS1.4
N$1
  Bottom 0.406: R2.1 26.04,20.32 R3.2
N$2
  Bottom 0.406: IC1.16 121.92,76.2 122.56,76.83 122.56,80.01 113.67,88.9 52.7,88.9 51.44,90.17 DDS1.6
N$3  (via drill 0.7)
  Top 0.406: DAC1.5 54.95,44.79 55.88,45.72 v55.88,48.26
  Bottom 0.406: IC1.15 124.46,71.12 126.36,69.22 126.36,64.14 124.94,62.71 111.76,62.71 109.7,60.64 90.49,60.64 88.9,59.05 88.9,52.07 87.63,50.8 58.42,50.8 v55.88,48.26
N$4
  Top 0.406: R5.2 60.01,31.43 60.01,46.67 59.05,47.62 59.05,54.61 54.61,59.05 IC5.2 54.61,62.87 R6.2
N$5
  Bottom 1.422: L2.1 121.83,36.79 | 121.83,36.79 C8.+ | 121.83,36.79 121.83,39.77 C40.1 121.92,42.86 IC2.1
N$6
  Bottom 0.406: K1.5 15.24,76.83 R7.1 15.24,81.92 IC8.1
N$7
  Bottom 1.422: D6.A D7.A 113.03,20 113.03,22.35 C31.- 110.32,22.99 L3.1
N$8
  Bottom 0.406: K1.4 17.78,76.83 18.73,77.79 30.48,77.79 31.11,77.15 33.66,77.15 33.97,77.47 39.37,77.47 46.35,84.45 DDS1.8
N$9
  Bottom 0.406: C17.1 52.07,51.44 51.75,51.75 51.12,51.75 IC5.5
N$10
  Bottom 0.406: C17.2 54.61,51.44 54.93,51.75 55.56,51.75 IC5.8
N$11
  Bottom 0.406: K1.3 22.54,73.34 32.07,73.34 R8.1
N$12
  Top 0.406: R11.1 43.18,62.23 R6.1
N$13
  Top 0.406: R13.1 LED1.A
N$14
  Bottom 1.422: D4.C 120.33,19.05 | 120.33,19.05 D5.C | L2.2 111.8,31.75 113.67,31.75 120.02,25.4 C30.+ 120.33,25.21 120.33,19.05
N$15
  Bottom 1.422: IC4.2 C41.2 100.97,17.78 C10.- 103.63,24.68 L3.2
N$16
  Bottom 1.422: D6.C 116.2,10.16 | 116.2,10.16 117.47,11.43 121.28,11.43 122.56,10.16 D4.A | 116.2,10.16 114.94,11.43 C42.1 96.52,11.43 94.08,8.99 CON1.1
N$17
  Top 0.406: IC7.3 17.78,39.69 18.41,39.05 26.67,39.05 C22.2 | C21.2 30.16,38.73 30.48,38.42 LSP3.MP
  Bottom 0.406: IC6.6 34.29,35.56 LSP3.MP | C21.2 C22.2
N$18
  Top 0.406: IC1.23 104.14,75.56 104.78,76.2 104.78,81.92 103.5,83.19 SG1.+
N$19
  Bottom 1.422: D7.C 113.03,6.99 | 113.03,6.99 114.3,5.71 118.11,5.71 119.38,6.99 D5.A | 113.03,6.99 112.39,6.35 C42.2 CON1.3
N$20
  Bottom 0.406: R10.1 30.16,92.71 29.21,91.76 IC8.9 29.21,87.63 28.26,86.68 26.67,86.68 | 26.67,86.68 25.08,86.68 24.13,87.63 | 24.13,87.63 IC8.11 | IC8.13 19.05,87.63 20,86.68 21.59,86.68 | 21.59,86.68 23.18,86.68 24.13,87.63 | IC8.3 21.59,86.68 | IC8.5 26.67,86.68
N$21
  Bottom 0.406: IC7.2 15.24,42.86 15.88,43.5 23.81,43.5 24.13,43.18 R16.1
N$22  (via drill 0.7)
  Top 0.406: DAC1.8 53,42.84 52.7,42.55 C38.2 49.53,42.86 v45.09,47.31 | R14.2 R9.2 18.41,56.2 19.37,55.24 19.37,53.02 17.78,51.44 IC7.6
  Bottom 0.406: v45.09,47.31 21.59,47.31 20.95,46.67 18.1,46.67 17.78,46.99 IC7.6
N$23
  Bottom 0.406: K1.10 21.59,69.22 R14.1 | R14.1 R9.1 | LSP4.MP 26.04,66.04 24.77,67.31 R14.1
N$24
  Bottom 0.406: R17.1 106.68,39.37 LED3.A
N$25
  Bottom 0.406: R18.2 93.98,40.64 LED4.K
N$26
  Top 0.406: IC6.5 35.88,36.51 36.51,36.51 36.83,36.2 C20.1
N$27
  Top 0.406: SJ1.2 R19.1
N$28
  Top 0.406: IC6.8 40.32,36.51 39.69,36.51 39.37,36.2 C20.2
N$29  (via drill 0.7)
  Top 0.406: DAC1.1 53,39.71 52.7,40.01 C38.1 | v39.37,42.55 IC6.2
  Bottom 0.406: C38.1 46.99,42.55 v39.37,42.55 C21.1 C22.1
N$30
  Top 0.406: SJ2.2 R20.1
N$31
  Bottom 0.406: K1.9 17.78,71.75 17.14,72.39 13.97,72.39 12.7,71.12 5.12,71.12 CON2.2
N$32
  Top 0.406: IC5.3 50.8,62.23 50.8,64.77 R8.2
  Bottom 0.406: IC5.3 53.66,62.55 55.56,62.55 C24.1 | R8.2 49.53,68.58 Q3.D
N$34
  Bottom 0.406: R2.2 29.21,25.4 C12.1 33.66,26.04 43.81,26.04 44.45,26.67 IC3.3
N$35
  Bottom 0.406: R4.1 31.43,30.48 28.89,27.94 R2.3 D2.1 C11.2
N$37
  Bottom 0.406: K1.12 28.57,70.48 29.21,69.85 D3.A 29.21,66.04 30.48,64.77 30.48,60.96 | Q2.D 30.48,60.96 | 30.48,60.96 LED2.K
N$38
  Top 0.406: IC8.2 19.05,80.01 17.78,78.74 15.24,78.74 13.34,76.83 13.34,72.39 K1.8
N$48
  Bottom 0.406: LED2.A 32.38,64.77 R15.2
OSC1
  Top 0.406: IC1.9 111.76,61.72 Q1.2 112.52,59.18 111.12,57.78 C1.2
OSC2
  Top 0.406: C2.2 118.75,59.56 Q1.1 114.3,64.01 IC1.10
PB0
  Bottom 0.406: Q2.G 32.38,55.88 43.18,55.88 44.13,56.83 64.77,56.83 66.67,58.74 R12.2 | IC1.14 124.46,64.45 123.83,63.82 68.9,63.82 68.58,64.14 R12.2 | Q3.G 65.41,65.41 R12.2
PC1  (via drill 0.7)
  Top 0.406: IC1.24 101.6,75.56 100.97,76.2 v100.97,79.38
  Bottom 0.406: v100.97,79.38 88.27,79.38 87.63,80.01 LED1.K
PC2
  Top 0.406: S2.1 88.42,92.71 88.42,86.36 S2.2
  Bottom 0.406: S2.2 88.42,86.2 94.77,86.2 96.52,84.45 96.52,81.92 97.79,80.64 103.19,80.64 104.46,79.38 104.46,76.83 103.5,75.88 99.38,75.88 99.06,75.56 IC1.25
RESET
  Top 0.406: D1.A R1.1 91.44,63.5 IC1.1 91.44,68.58 92.71,69.85 92.71,79.38 90.17,81.92 90.17,96.52 91.44,97.79 110.49,97.79 111.76,96.52 ISP.5
  Bottom 0.406: C5.1 101.6,55.88 99.17,55.88 S1.3 S1.4 92.63,58.98 D1.A
RXD
  Top 0.406: IC1.2 93.98,68.58 95.25,69.85 95.25,90.17 92.71,92.71 SV2.1
SCK  (via drill 0.7)
  Top 0.406: DAC1.3 54.3,40.32 53.34,41.27 v46.35,41.27 | DDS1.5 53.98,79.38 37.47,62.87 37.47,50.16 40.64,46.99 v40.64,41.27
  Bottom 0.406: 102.87,90.17 54.93,90.17 53.98,91.12 DDS1.5 | ISP.7 107.63,96.84 105.73,96.84 104.14,95.25 104.14,91.44 | 104.14,91.44 105.41,90.17 | 105.41,90.17 114.3,90.17 123.83,80.64 123.83,76.2 123.19,75.56 123.19,71.75 122.56,71.12 114.94,71.12 114.3,71.75 IC1.19 | 104.14,91.44 102.87,90.17 | v40.64,41.27 v46.35,41.27 | 102.87,90.17 105.41,90.17
SCL  (via drill 0.7)
  Top 0.406: v82.55,71.75 82.55,60.96 80.64,59.05 80.64,23.5 80.01,22.86 75.56,22.86 74.3,21.59 74.3,13.34 77.47,10.16 R20.2
  Bottom 0.406: SV1.4 R20.2 | IC1.28 89.53,73.66 88.9,73.03 83.82,73.03 v82.55,71.75
SDA  (via drill 0.7)
  Top 0.406: v83.82,69.85 83.82,60.33 81.92,58.42 81.92,22.86 80.64,21.59 76.2,21.59 75.56,20.95 75.56,13.97 80.64,8.89 R19.2
  Bottom 0.406: SV1.3 66.04,6.99 66.67,7.62 78.11,7.62 R19.2 | IC1.27 93.98,71.75 93.34,71.12 87.63,71.12 87,71.75 85.72,71.75 v83.82,69.85
SELECT-SW  (via drill 0.7)
  Top 0.406: v86.36,11.43 86.36,44.45 v90.81,48.9 | v100.97,48.9 102.87,48.9 106.68,52.7 119.38,52.7 121.92,55.24 IC1.13
  Bottom 0.406: SV3.4 85.09,10.16 v86.36,11.43 | v90.81,48.9 v100.97,48.9
TXD
  Top 0.406: IC1.3 96.52,68.58 97.79,69.85 97.79,76.83 97.16,77.47 97.16,90.81 95.25,92.71 SV2.2
VCC  (via drill 0.9)
  Top 0.813: SJ2.1 SJ1.1 82.68,19.18 C37.1 | D3.C 29.21,77.47 30.48,78.74 R15.1 34.92,78.74 C26.+ 35.56,86.36 34.92,87 17.14,87 16.51,87.63 IC8.14
  Top 1.016: C6.1 IC1.7 | C37.1 v83.82,45.72 83.82,57.15 R13.2 88.9,62.23 v88.9,76.2 | R1.2 D1.C
  Bottom 0.813: R7.2 IC8.14 16.51,91.44 C27.1 R10.2 | R17.2 IC2.3 | v88.9,76.2 90.17,77.47 L1.1 | K1.1 D3.C
  Bottom 1.016: L4.2 81.28,48.26 v83.82,45.72 | C6.1 R1.2 | D1.C 102.87,57.78 106.68,53.98 106.68,50.8 | 106.68,50.8 C9.1 | v88.9,76.2 87.63,74.93 84.45,74.93 83.82,75.56 C39.2 D3.C | C37.1 77.47,20.32 72.39,15.24 60.96,15.24 58.42,12.7 58.42,2.86 59.05,2.22 62.87,2.22 63.5,2.86 SV1.2 | SV6.1 106.68,50.8
  Bottom 1.27: v83.82,45.72 C28.+ 105.41,45.72 C9.1 109.22,44.45 112.39,44.45 115.25,47.31 IC2.3
VREF
  Top 0.406: DAC1.7 53.65,44.78 LSP2.MP 49.53,50.8 IC5.6 | R11.2 R11.3
  Bottom 0.406: LSP2.MP 45.09,53.34 41.91,53.34 R11.3

### Text on the board
tPlace: GND | Rx | Tx | G | User | Reset | +5V | IA | IB | IS | SS | Function Generator with AD9833 / tj, Rev. 1.1, 2021 | GND | G | SD | SC | +